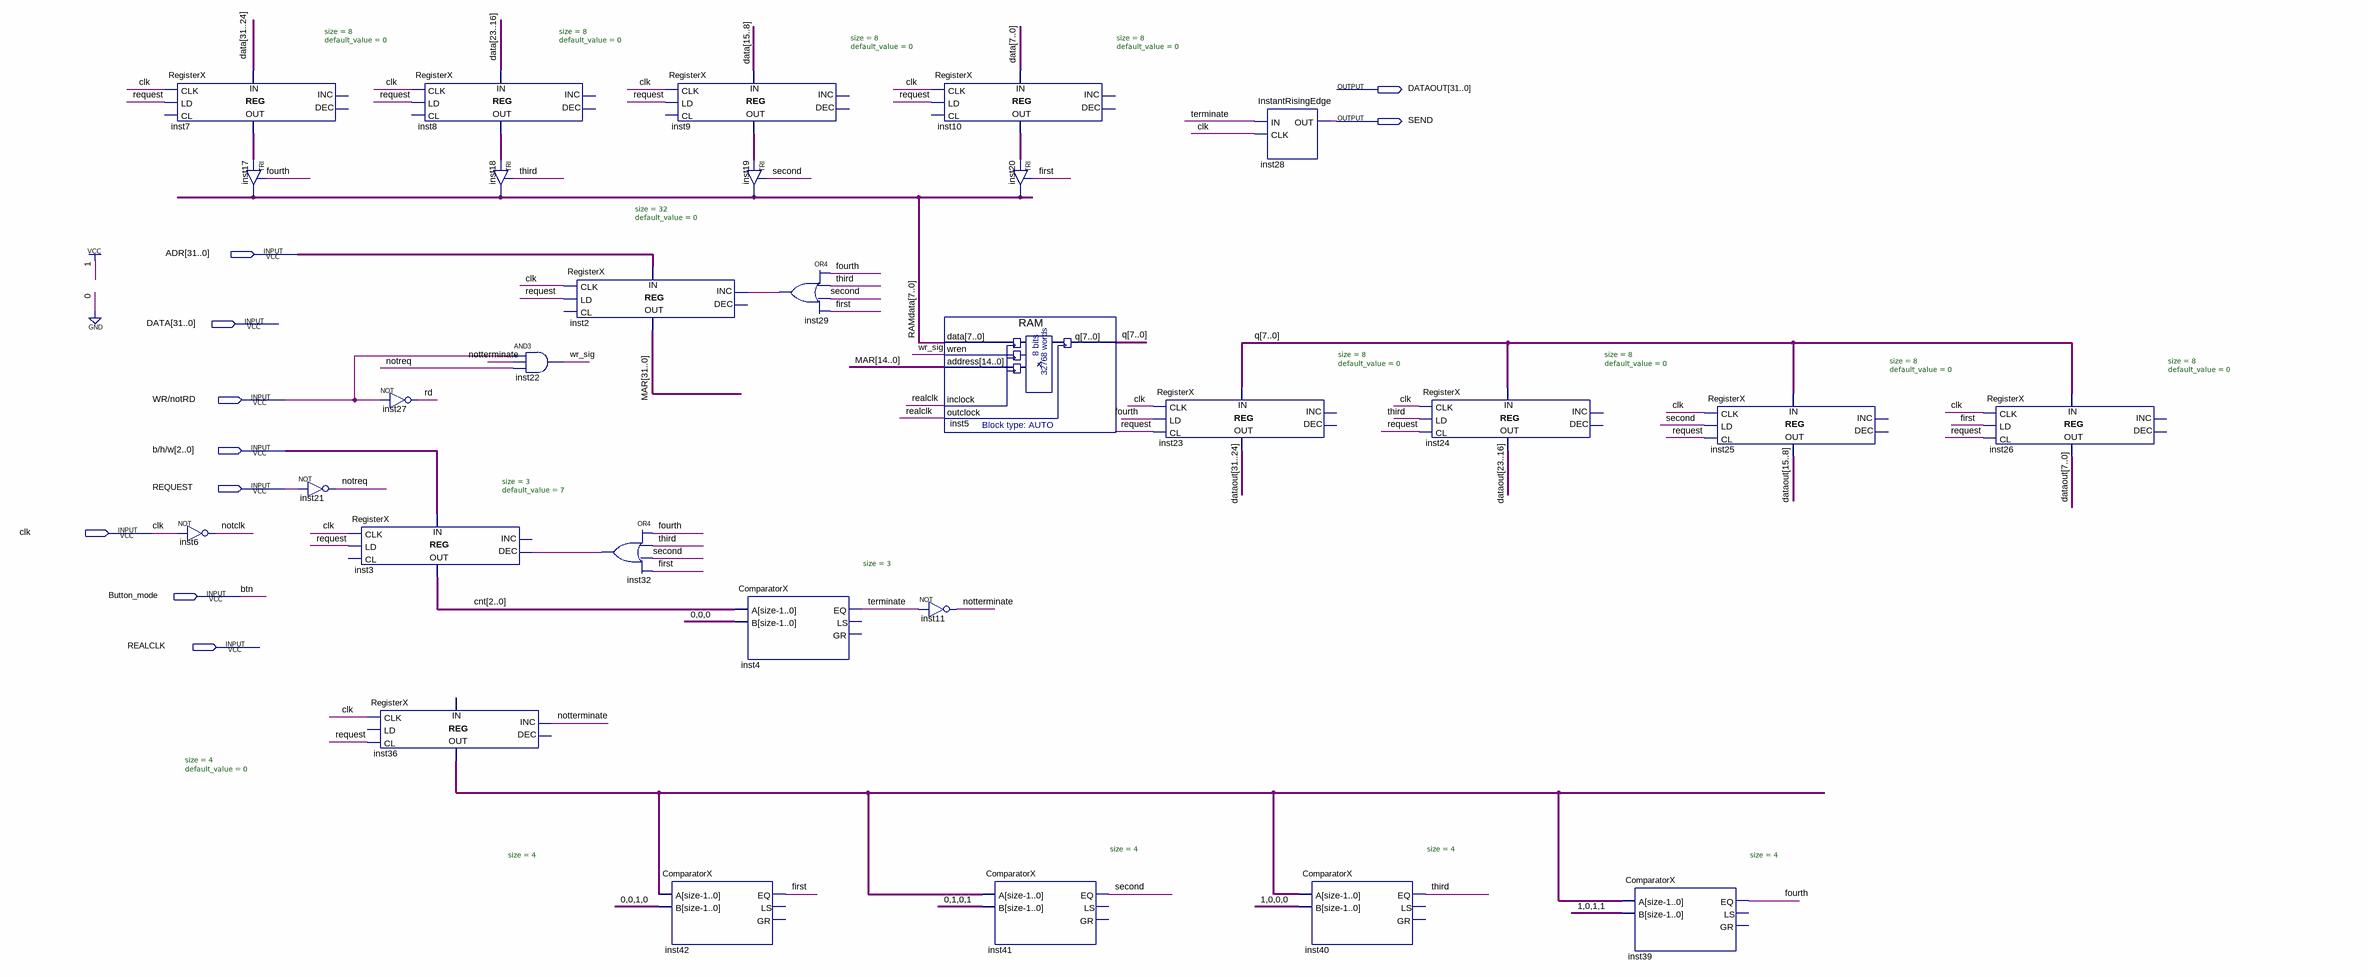
[diagram p0: schematic sheet]
// Quartus schematic Memory.bdf as structural Verilog: 29 symbols, 10 pins
module Memory (
  input  [31:0] ADR,
  input  [31:0] DATA,
  input  \WR/notRD ,
  input  [2:0] \b/h/w ,
  input  REQUEST,
  input  clk,
  input  Button_mode,
  input  REALCLK,
  output [31:0] DATAOUT,
  output SEND
);

  wire first, fourth, inst29_out, inst32_out, notclk, notreq, notterminate, rd, second, terminate, third,
       wr_sig;
  wire [2:0] cnt;
  wire [3:0] inst36_data_out;
  wire [7:0] inst7_data_out, inst8_data_out, inst9_data_out, inst10_data_out, q, RAMdata;
  wire [31:0] MAR;

  RegisterX #(.size(8), .default_value(0)) inst7 (
    .CLK(clk), .LD(REQUEST), .DATA_IN(DATA[31:24]), .DATA_OUT(inst7_data_out));  // open: CL, INC, DEC
  not inst6 (notclk, clk);
  TRI inst17[7:0] (.IN(inst7_data_out), .OE(fourth), .OUT(RAMdata));
  not inst21 (notreq, REQUEST);
  not inst27 (rd, \WR/notRD );
  RegisterX #(.size(3), .default_value(7)) inst3 (
    .CLK(clk), .LD(REQUEST), .DEC(inst32_out), .DATA_IN(\b/h/w ), .DATA_OUT(cnt));  // open: CL, INC
  RegisterX #(.size(4), .default_value(0)) inst36 (
    .CLK(clk), .CL(REQUEST), .INC(notterminate), .DATA_OUT(inst36_data_out));  // open: LD, DEC, DATA_IN
  RegisterX #(.size(8), .default_value(0)) inst8 (
    .CLK(clk), .LD(REQUEST), .DATA_IN(DATA[23:16]), .DATA_OUT(inst8_data_out));  // open: CL, INC, DEC
  TRI inst18[7:0] (.IN(inst8_data_out), .OE(third), .OUT(RAMdata));
  and inst22 (wr_sig, \WR/notRD , notterminate, notreq);
  RegisterX #(.size(32), .default_value(0)) inst2 (
    .CLK(clk), .LD(REQUEST), .INC(inst29_out), .DATA_IN(ADR), .DATA_OUT(MAR));  // open: CL, DEC
  or inst32 (inst32_out, fourth, third, second, first);
  RegisterX #(.size(8), .default_value(0)) inst9 (
    .CLK(clk), .LD(REQUEST), .DATA_IN(DATA[15:8]), .DATA_OUT(inst9_data_out));  // open: CL, INC, DEC
  ComparatorX #(.size(4)) inst42 (.A(inst36_data_out), .B(4'b0010), .EQ(first));  // open: LS, GR
  ComparatorX #(.size(3)) inst4 (.A(cnt), .B(3'b000), .EQ(terminate));  // open: LS, GR
  TRI inst19[7:0] (.IN(inst9_data_out), .OE(second), .OUT(RAMdata));
  or inst29 (inst29_out, fourth, third, second, first);
  RegisterX #(.size(8), .default_value(0)) inst10 (
    .CLK(clk), .LD(REQUEST), .DATA_IN(DATA[7:0]), .DATA_OUT(inst10_data_out));  // open: CL, INC, DEC
  not inst11 (notterminate, terminate);
  RAM inst5 (.data(RAMdata), .wren(wr_sig), .address(MAR[14:0]), .inclock(REALCLK), .outclock(REALCLK), .q(q));
  ComparatorX #(.size(4)) inst41 (.A(inst36_data_out), .B(4'b0101), .EQ(second));  // open: LS, GR
  TRI inst20[7:0] (.IN(inst10_data_out), .OE(first), .OUT(RAMdata));
  RegisterX #(.size(8), .default_value(0)) inst23 (
    .CLK(clk), .LD(fourth), .CL(REQUEST), .DATA_IN(q), .DATA_OUT(DATAOUT[31:24]));  // open: INC, DEC
  InstantRisingEdge inst28 (.IN(terminate), .CLK(clk), .OUT(SEND));
  ComparatorX #(.size(4)) inst40 (.A(inst36_data_out), .B(4'b1000), .EQ(third));  // open: LS, GR
  RegisterX #(.size(8), .default_value(0)) inst24 (
    .CLK(clk), .LD(third), .CL(REQUEST), .DATA_IN(q), .DATA_OUT(DATAOUT[23:16]));  // open: INC, DEC
  ComparatorX #(.size(4)) inst39 (.A(inst36_data_out), .B(4'b1011), .EQ(fourth));  // open: LS, GR
  RegisterX #(.size(8), .default_value(0)) inst25 (
    .CLK(clk), .LD(second), .CL(REQUEST), .DATA_IN(q), .DATA_OUT(DATAOUT[15:8]));  // open: INC, DEC
  RegisterX #(.size(8), .default_value(0)) inst26 (
    .CLK(clk), .LD(first), .CL(REQUEST), .DATA_IN(q), .DATA_OUT(DATAOUT[7:0]));  // open: INC, DEC

  // Other names for the same wires on the sheet: btn = Button_mode
endmodule
